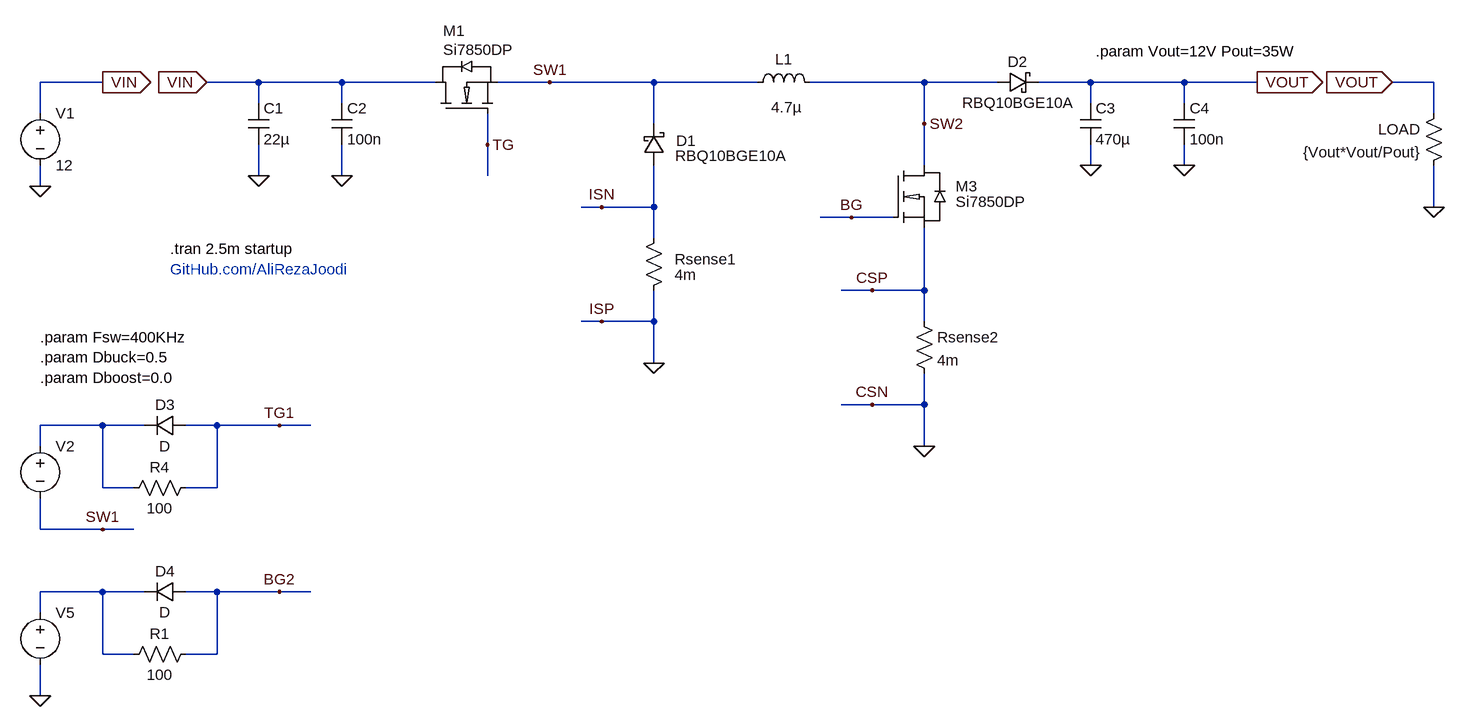
[diagram p0: schematic _PowerStage.asc]
_PowerStage.asc, the LTspice schematic file:
Version 4.1
SHEET 1 2228 2032
WIRE -896 -1408 -992 -1408
WIRE -656 -1408 -736 -1408
WIRE -528 -1408 -656 -1408
WIRE -384 -1408 -528 -1408
WIRE -208 -1408 -288 -1408
WIRE -48 -1408 -208 -1408
WIRE 112 -1408 -48 -1408
WIRE 368 -1408 192 -1408
WIRE 480 -1408 368 -1408
WIRE 624 -1408 544 -1408
WIRE 768 -1408 624 -1408
WIRE 880 -1408 768 -1408
WIRE 1152 -1408 1088 -1408
WIRE -656 -1376 -656 -1408
WIRE -528 -1376 -528 -1408
WIRE 624 -1376 624 -1408
WIRE 768 -1376 768 -1408
WIRE -992 -1360 -992 -1408
WIRE 1152 -1360 1152 -1408
WIRE -48 -1344 -48 -1408
WIRE 368 -1344 368 -1408
WIRE -304 -1312 -304 -1360
WIRE 368 -1280 368 -1344
WIRE 624 -1280 624 -1312
WIRE 768 -1280 768 -1312
WIRE -656 -1264 -656 -1312
WIRE -528 -1264 -528 -1312
WIRE -304 -1264 -304 -1312
WIRE -992 -1248 -992 -1280
WIRE -128 -1216 -160 -1216
WIRE -48 -1216 -48 -1280
WIRE -48 -1216 -128 -1216
WIRE 1152 -1216 1152 -1280
WIRE 256 -1200 208 -1200
WIRE 320 -1200 256 -1200
WIRE -48 -1168 -48 -1216
WIRE 288 -1088 240 -1088
WIRE 368 -1088 368 -1184
WIRE 368 -1088 288 -1088
WIRE -128 -1040 -160 -1040
WIRE -48 -1040 -48 -1088
WIRE -48 -1040 -128 -1040
WIRE 368 -1040 368 -1088
WIRE -48 -976 -48 -1040
WIRE 288 -912 240 -912
WIRE 368 -912 368 -960
WIRE 368 -912 288 -912
WIRE -896 -880 -992 -880
WIRE -832 -880 -896 -880
WIRE -720 -880 -768 -880
WIRE -624 -880 -720 -880
WIRE -576 -880 -624 -880
WIRE -992 -848 -992 -880
WIRE 368 -848 368 -912
WIRE -896 -784 -896 -880
WIRE -848 -784 -896 -784
WIRE -720 -784 -720 -880
WIRE -720 -784 -768 -784
WIRE -992 -720 -992 -768
WIRE -896 -720 -992 -720
WIRE -848 -720 -896 -720
WIRE -896 -624 -992 -624
WIRE -832 -624 -896 -624
WIRE -720 -624 -768 -624
WIRE -624 -624 -720 -624
WIRE -576 -624 -624 -624
WIRE -992 -592 -992 -624
WIRE -896 -528 -896 -624
WIRE -848 -528 -896 -528
WIRE -720 -528 -720 -624
WIRE -720 -528 -768 -528
WIRE -992 -464 -992 -512
FLAG -992 -1248 0
FLAG -48 -976 0
FLAG 1152 -1216 0
FLAG 1088 -1408 VOUT
IOPIN 1088 -1408 In
FLAG 624 -1280 0
FLAG 256 -1200 BG
FLAG 368 -1344 SW2
FLAG -304 -1312 TG
FLAG -208 -1408 SW1
FLAG 288 -912 CSN
FLAG 288 -1088 CSP
FLAG -128 -1040 ISP
FLAG -128 -1216 ISN
FLAG 768 -1280 0
FLAG -656 -1264 0
FLAG -528 -1264 0
FLAG -896 -1408 VIN
IOPIN -896 -1408 Out
FLAG -736 -1408 VIN
IOPIN -736 -1408 In
FLAG 880 -1408 VOUT
IOPIN 880 -1408 Out
FLAG -896 -720 SW1
FLAG -624 -880 TG1
FLAG -992 -464 0
FLAG -624 -624 BG2
FLAG 368 -848 0
SYMBOL voltage -992 -1376 R0
WINDOW 123 0 0 Left 0
WINDOW 39 0 0 Left 0
SYMATTR InstName V1
SYMATTR Value 12
SYMBOL res -64 -1072 M180
WINDOW 0 48 64 Left 2
WINDOW 3 48 40 Left 2
SYMATTR InstName Rsense1
SYMATTR Value 4m
SYMBOL schottky -64 -1280 M180
WINDOW 0 50 38 Left 2
WINDOW 3 49 15 Left 2
SYMATTR InstName D1
SYMATTR Value RBQ10BGE10A
SYMATTR Description Diode
SYMATTR Type diode
SYMBOL schottky 480 -1392 R270
WINDOW 0 32 32 VTop 2
WINDOW 3 0 32 VBottom 2
SYMATTR InstName D2
SYMATTR Value RBQ10BGE10A
SYMATTR Description Diode
SYMATTR Type diode
SYMBOL ind 96 -1392 R270
WINDOW 0 36 56 VTop 2
WINDOW 3 -7 60 VBottom 2
SYMATTR InstName L1
SYMATTR Value 4.7µ
SYMATTR SpiceLine Rpar=1K
SYMBOL res 352 -1056 R0
SYMATTR InstName Rsense2
SYMATTR Value 4m
SYMBOL cap 608 -1376 R0
SYMATTR InstName C3
SYMATTR Value 470µ
SYMATTR SpiceLine Rser=20m
SYMBOL res 1168 -1376 M0
SYMATTR InstName LOAD
SYMATTR Value {Vout*Vout/Pout}
SYMBOL cap 752 -1376 R0
SYMATTR InstName C4
SYMATTR Value 100n
SYMATTR SpiceLine Rser=100m
SYMBOL cap -672 -1376 R0
SYMATTR InstName C1
SYMATTR Value 22µ
SYMBOL cap -544 -1376 R0
SYMATTR InstName C2
SYMATTR Value 100n
SYMBOL MyLib\\Transistor_MOSFET_N\\MOSFET_N -384 -1360 R270
WINDOW 0 127 12 VRight 2
WINDOW 3 98 12 VRight 2
SYMATTR InstName M1
SYMATTR Value Si7850DP
SYMBOL MyLib\\Transistor_MOSFET_N\\MOSFET_N 320 -1280 R0
SYMATTR InstName M3
SYMATTR Value Si7850DP
SYMBOL voltage -992 -864 R0
WINDOW 3 41 64 Invisible 2
WINDOW 123 0 0 Left 0
WINDOW 39 0 0 Left 0
SYMATTR Value PULSE(0 12 0 {0.01/Fsw} {0.01/Fsw} {Dbuck/Fsw} {1/Fsw})
SYMATTR InstName V2
SYMBOL voltage -992 -608 R0
WINDOW 3 41 64 Invisible 2
WINDOW 123 0 0 Left 0
WINDOW 39 0 0 Left 0
SYMATTR Value PULSE(0 12 0 {0.01/Fsw} {0.01/Fsw} {Dboost/Fsw} {1/Fsw})
SYMATTR InstName V5
SYMBOL diode -768 -640 R90
WINDOW 0 0 32 VBottom 2
WINDOW 3 32 32 VTop 2
SYMATTR InstName D4
SYMBOL res -864 -512 R270
WINDOW 0 32 56 VTop 2
WINDOW 3 0 56 VBottom 2
SYMATTR InstName R1
SYMATTR Value 100
SYMBOL diode -768 -896 R90
WINDOW 0 0 32 VBottom 2
WINDOW 3 32 32 VTop 2
SYMATTR InstName D3
SYMBOL res -864 -768 R270
WINDOW 0 32 56 VTop 2
WINDOW 3 0 56 VBottom 2
SYMATTR InstName R4
SYMATTR Value 100
TEXT -792 -1152 Left 2 !.tran 2.5m startup
TEXT 632 -1456 Left 2 !.param Vout=12V Pout=35W
TEXT -792 -1120 Left 2 ;GitHub.com/AliRezaJoodi
TEXT -992 -1016 Left 2 !.param Fsw=400KHz\n.param Dbuck=0.5\n.param Dboost=0.0

The netlist it stands for:
* _PowerStage.asc
V1 VIN 0 12
Rsense1 0 ISN 4m
D1 ISN SW1 RBQ10BGE10A
D2 SW2 VOUT RBQ10BGE10A
L1 SW1 SW2 4.7µ Rpar=1K
Rsense2 CSP 0 4m
C3 VOUT 0 470µ Rser=20m
R§LOAD VOUT 0 {Vout*Vout/Pout}
C4 VOUT 0 100n Rser=100m
C1 VIN 0 22µ
C2 VIN 0 100n
M1 VIN TG SW1 SW1 Si7850DP
M3 SW2 BG CSP CSP Si7850DP
V2 N001 SW1 PULSE(0 12 0 {0.01/Fsw} {0.01/Fsw} {Dbuck/Fsw} {1/Fsw})
V5 N002 0 PULSE(0 12 0 {0.01/Fsw} {0.01/Fsw} {Dboost/Fsw} {1/Fsw})
D4 BG2 N002 D
R1 N002 BG2 100
D3 TG1 N001 D
R4 N001 TG1 100
.model D D
.lib standard.dio
.model NMOS NMOS
.model PMOS PMOS
.lib standard.mos
.tran 2.5m startup
.param Vout=12V Pout=35W
* GitHub.com/AliRezaJoodi
.param Fsw=400KHz
.param Dbuck=0.5
.param Dboost=0.0
.backanno
.end